# Altium project Power_Management_Board.PrjPcb
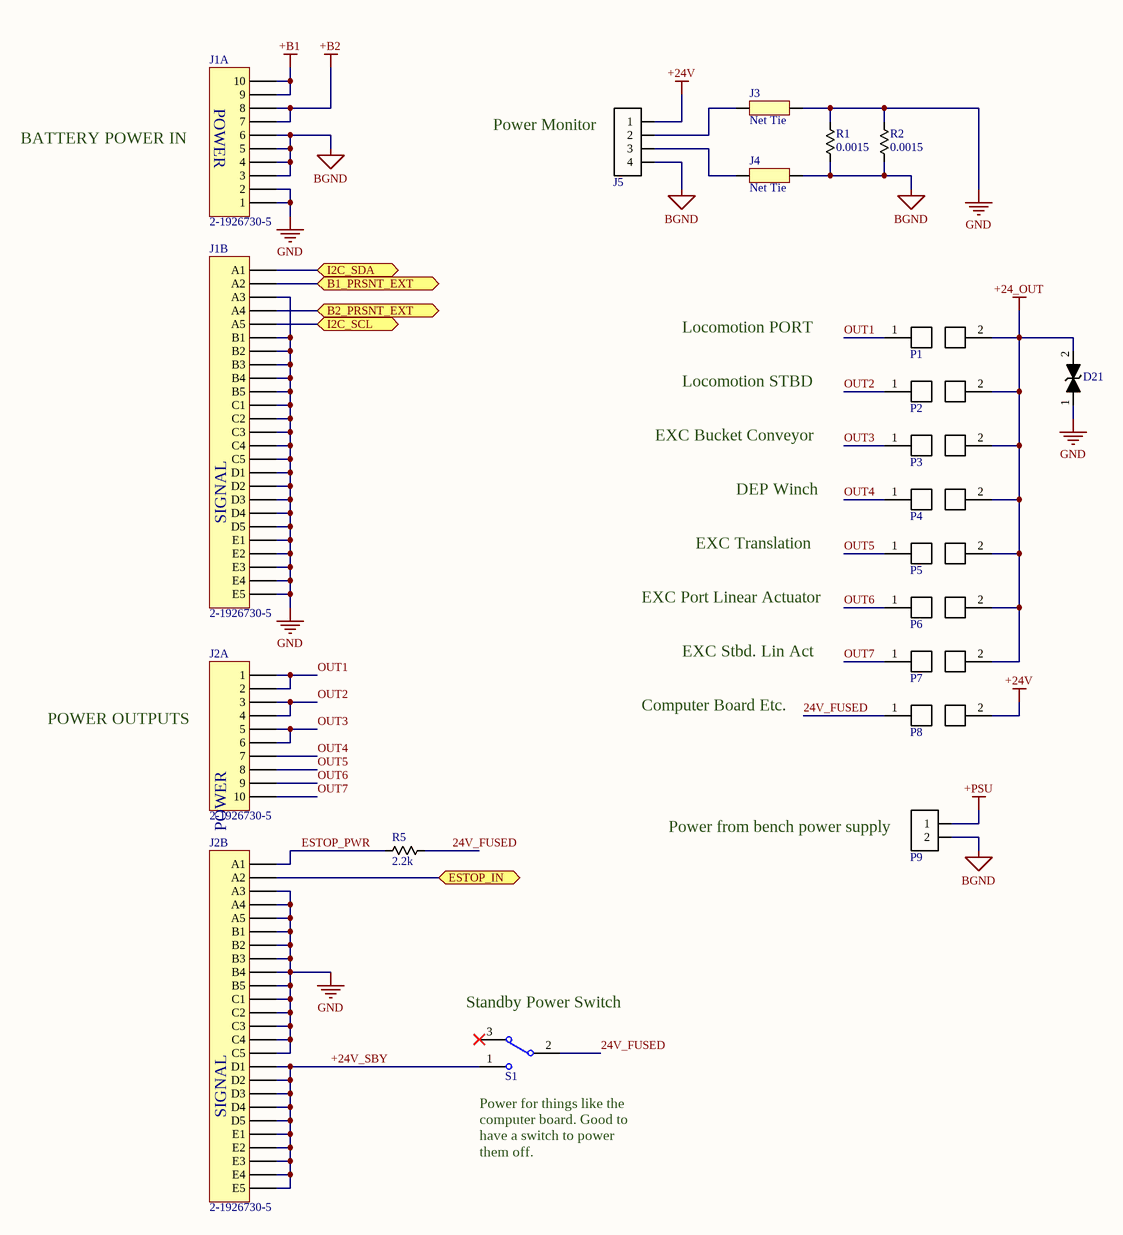
[diagram p0: SCH1_Connectors.SchDoc]
3 sheets, 145 parts. Net scope: flat (ports and power ports of the same name join across sheets).
Board file: Power_Management_Board.PcbDoc
Sheets:
  SCH1_Connectors.SchDoc
  SCH2_Switching.SchDoc
  SCH3_Microcontroller.SchDoc

## Sheet SCH1_Connectors.SchDoc
size B; Organization: CWRUbotix; Address1: 10900 Euclid Avenue; Address2: Cleveland, OH 44106; Address3: USA

### Parts
D21  diode_5  [do-214ab]  (value not drawn)
J1  2-1926730-5  [TE_CONN_2-1926730-5]  (parts A,B of 2)
J2  2-1926730-5  [TE_CONN_2-1926730-5]  (parts A,B of 2)
J3  Net Tie  [net_tie_0]
J4  Net Tie  [net_tie_0]
J5  conn-4x1_0  [PHOENIX_1757268]  (value not drawn)
P1  conn-fuse-holder_0  [FUSE_HOLDER_KEYSTONE_3557-2]  (value not drawn)
P2  conn-fuse-holder_0  [FUSE_HOLDER_KEYSTONE_3557-2]  (value not drawn)
P3  conn-fuse-holder_0  [FUSE_HOLDER_KEYSTONE_3557-2]  (value not drawn)
P4  conn-fuse-holder_0  [FUSE_HOLDER_KEYSTONE_3557-2]  (value not drawn)
P5  conn-fuse-holder_0  [FUSE_HOLDER_KEYSTONE_3557-2]  (value not drawn)
P6  conn-fuse-holder_0  [FUSE_HOLDER_KEYSTONE_3557-2]  (value not drawn)
P7  conn-fuse-holder_0  [FUSE_HOLDER_KEYSTONE_3557-2]  (value not drawn)
P8  conn-fuse-holder_0  [FUSE_HOLDER_KEYSTONE_3557-2]  (value not drawn)
P9  conn-2x1_0  [PHOENIX_1757242]  (value not drawn)
R1  0.0015  [chip_2512]
R2  0.0015  [chip_2512]
R5  2.2k  [chip_0805]
S1  SW-SPDT  [M2012TXG41-DC]  (value not drawn)

### Ports
B1_PRSNT_EXT (bidir), B2_PRSNT_EXT (bidir), ESTOP_IN (bidir), I2C_SCL (bidir), I2C_SDA (bidir)

### Nets
+24_OUT: D21.2 P1.2 P2.2 P3.2 P4.2 P5.2 P6.2 P7.2
+24V: J5.1 P8.2
+B1: J1.9 J1.10
+B2: J1.7 J1.8
+PSU: P9.1
BGND: J1.3 J1.4 J1.5 J1.6 J4.2(NET2) J5.4 P9.2 R1.2 R2.2
GND: D21.1 J1.1 J1.2 J1.A3 J1.B1 J1.B2 J1.B3 J1.B4 J1.B5 J1.C1 J1.C2 J1.C3 J1.C4 J1.C5 J1.D1 J1.D2 J1.D3 J1.D4 J1.D5 J1.E1 J1.E2 J1.E3 J1.E4 J1.E5 J2.A3 J2.A4 J2.A5 J2.B1 J2.B2 J2.B3 J2.B4 J2.B5 J2.C1 J2.C2 J2.C3 J2.C4 J2.C5 J3.2(NET2) R1.1 R2.1
24V_FUSED: P8.1 R5.2 S1.2
+24V_SBY: J2.D1 J2.D2 J2.D3 J2.D4 J2.D5 J2.E1 J2.E2 J2.E3 J2.E4 J2.E5 S1.1
B1_PRSNT_EXT: J1.A2 ; port B1_PRSNT_EXT
B2_PRSNT_EXT: J1.A4 ; port B2_PRSNT_EXT
ESTOP_IN: J2.A2 ; port ESTOP_IN
ESTOP_PWR: J2.A1 R5.1
I2C_SCL: J1.A5 ; port I2C_SCL
I2C_SDA: J1.A1 ; port I2C_SDA
OUT1: J2.1 J2.2 P1.1
OUT2: J2.3 J2.4 P2.1
OUT3: J2.5 J2.6 P3.1
OUT4: J2.7 P4.1
OUT5: J2.8 P5.1
OUT6: J2.9 P6.1
OUT7: J2.10 P7.1
NetJ3_1: J3.1(NET1) J5.2
NetJ4_1: J4.1(NET1) J5.3

Not connected (* = marked no-connect by the designer): S1 3*

### Notes on the sheet
- BATTERY POWER IN
- (near J5) Power Monitor
- Locomotion PORT
- Locomotion STBD
- EXC Bucket Conveyor
- DEP Winch
- EXC Translation
- EXC Port Linear Actuator
- EXC Stbd. Lin Act
- POWER OUTPUTS
- Computer Board Etc.
- (near P9) Power from bench power supply
- (near S1) Standby Power Switch
- (near S1) Power for things like the computer board. Good to have a switch to power them off.
- Title
- Size:
- B
- Number:
- Revision:
- Date:
- Sheet
- of
- (in symbol CONN-00093, part A) POWER
- (in symbol CONN-00093, part B) SIGNAL

### Library data of the parts
D21 = DIO-00090: TVS, 28V, 45.5V@66A, 3kW 66A Peak, Bidirectional, DO-214AC; Manufacturer: ST; Manufacturer PN: SMC30J28CA; Reverse Breakdown Voltage: 31.1V; Power Rating: 3000W; Part Number: DIO-00090; Current Rating: 66A; Type: TVS; Cost: 1.2; Distributor Link: https://www.digikey.com/en/products/detail/stmicroelectronics/SMC30J28CA/2826980
J1 J2 = CONN-00093: Backplane Header, Blades and Pins, Edge Mount Right Angle, 10 Power 25 Signal; Manufacturer: TE Connectivity; Positions per level: 35; Levels: 1; Part Number: CONN-00093; Type: Header; Manufacturer PN: 2-1926730-5; Cost: 11.68
J3 J4 = MISC-00039: Part Number: MISC-00039
J5 = CONN-00096: Terminal Block Header, 4 pos, 12A 300V, Right-Angle, THT; Manufacturer: Phoenix Contact; Manufacturer PN: 1757268; Positions per level: 4; Levels: 1; Part Number: CONN-00096; Type: Terminal Block; Cost: 1.4
P1-P8 = CONN-00015: Fuse Holder, 30A, 500V, LP-Mini 897, ATOF 257; Manufacturer: Keystone Electronics; Manufacturer PN: 3557-2; Positions per level: 2; Levels: 1; Current: 30; Part Number: CONN-00015; Cost: 1.03
P9 = CONN-00102: Terminal Blk Header, 2 Pos, 5.08mm, 12A, Right-Angle; Manufacturer: Phoenix Contact; Manufacturer PN: 1757242; Positions per level: 2; Levels: 1; Part Number: CONN-00102; Type: Terminal Block; Cost: 0.64
R1 R2 = RES-00716: RES SMD 0.0015 OHM 1% 3W 2512 50ppm, Current Sense; Manufacturer: TE Connectivity; Manufacturer PN: TLR3A30DR0015FTDG; Part Number: RES-00716; Resistance: 0.0015; Tolerance: 1%; Power Rating: 3W; Cost: 1.04
R5 = RES-00366: RES SMD 2.2K OHM 1% 1/8W 0805; Manufacturer: Rohm Semiconductor; Manufacturer PN: KTR10EZPF2201; Power Rating: 0.125W; Part Number: RES-00366; Resistance: 2.2k; Tolerance: 1%
S1 = MISC-00009: Switch, SPDT, Rocker, Thru-hole, Right-angle; Manufacturer: NKK Switches; Manufacturer PN: M2012TXW41-DA; Part Number: MISC-00009; Cost: 5.1; Weight: 6

## Sheet SCH2_Switching.SchDoc
size B; Organization: CWRUbotix; Address1: 10900 Euclid Avenue; Address2: Cleveland, OH 44106; Address3: USA
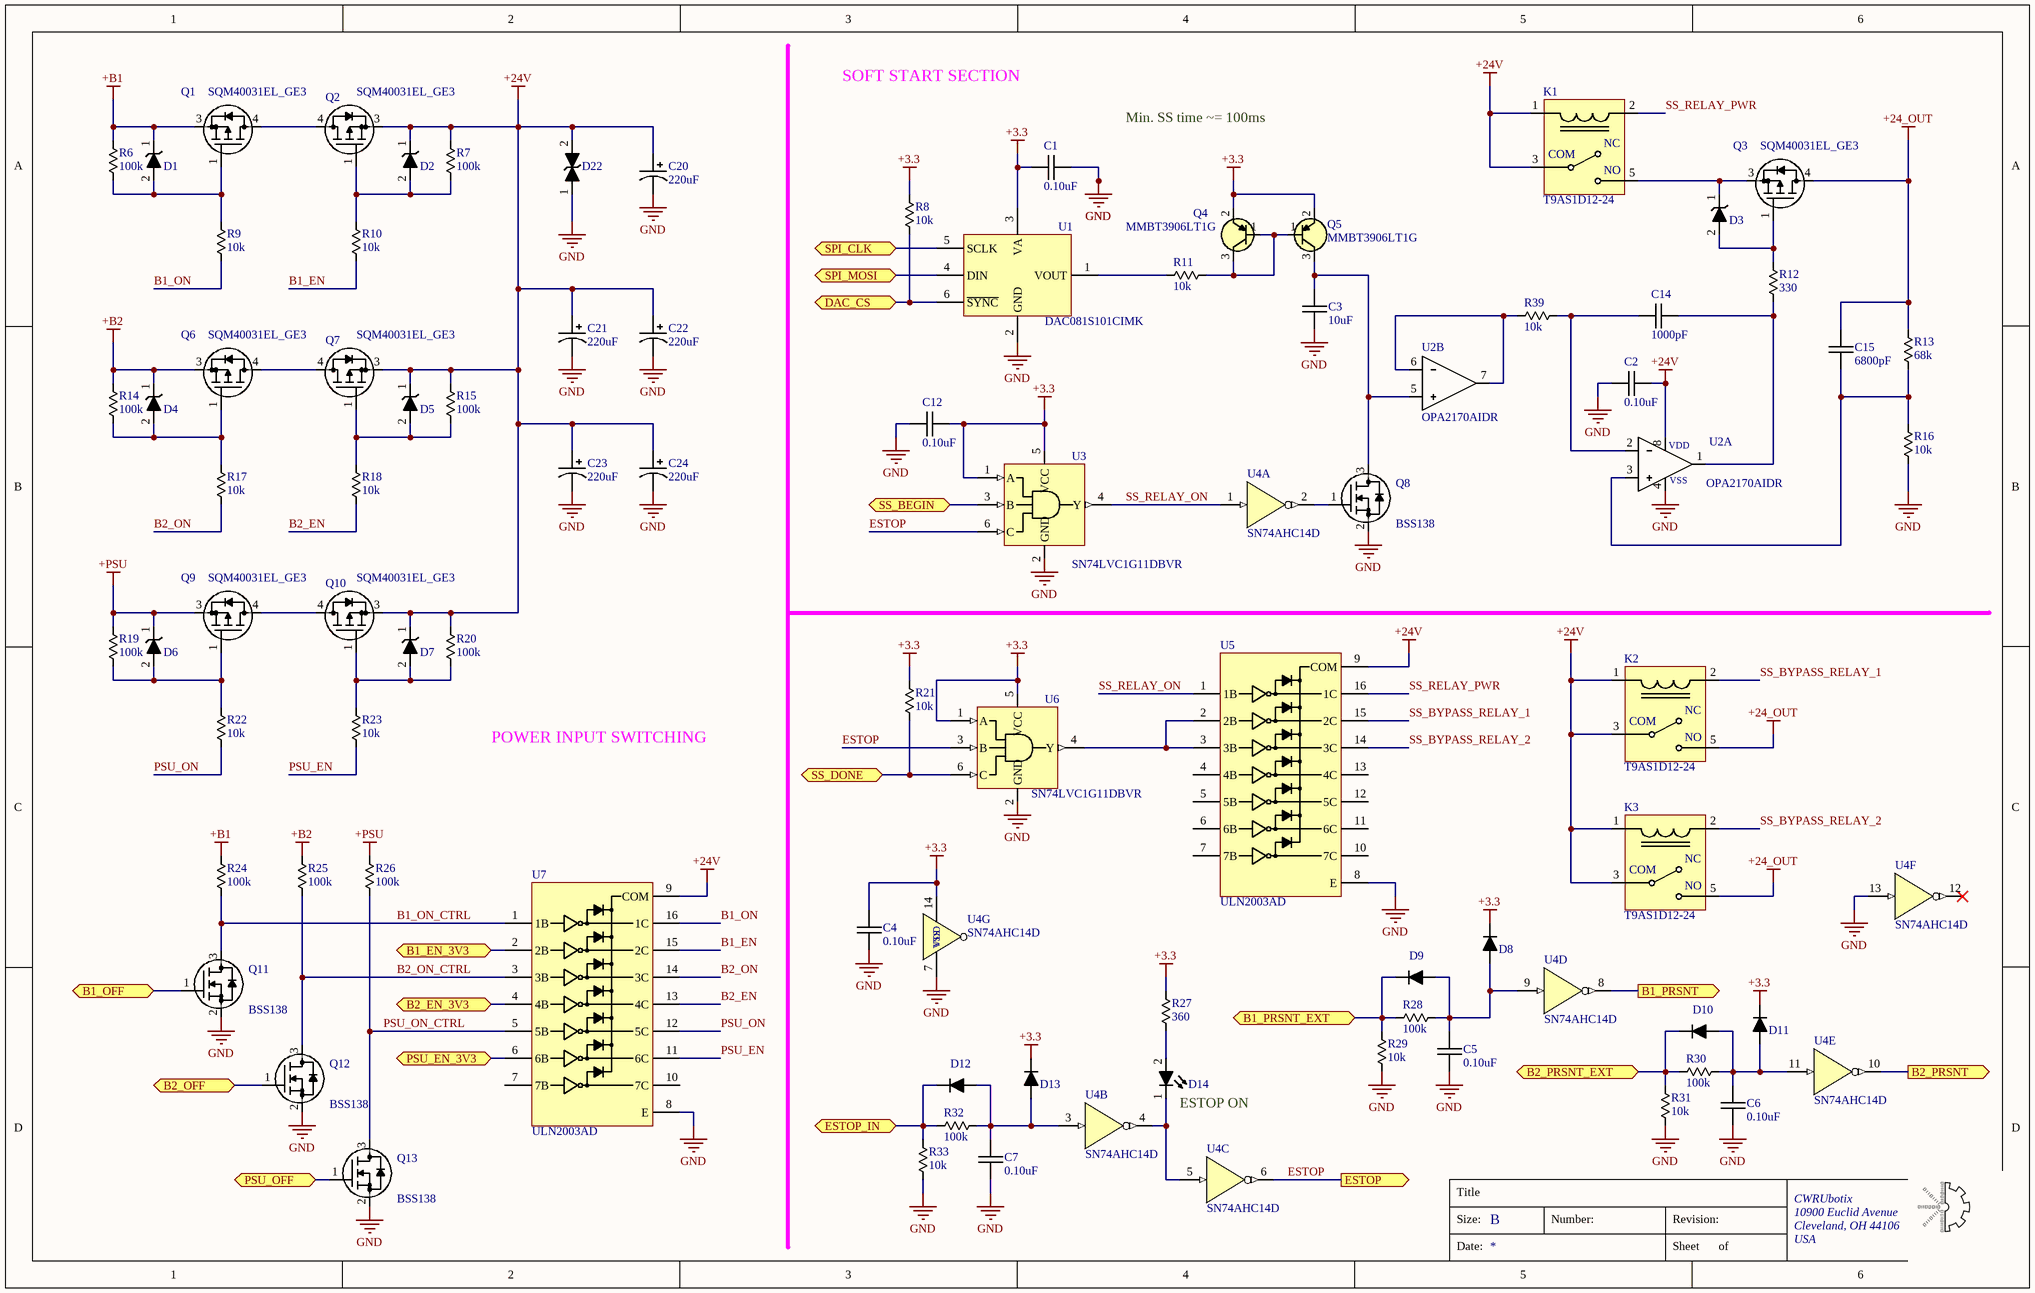
[diagram p1: SCH2_Switching.SchDoc]

### Parts
C1  0.10uF  [chip_0805]
C2  0.10uF  [chip_0805]
C3  10uF  [chip_1206]
C4  0.10uF  [chip_0805]
C5  0.10uF  [chip_0805]
C6  0.10uF  [chip_0805]
C7  0.10uF  [chip_0805]
C12  0.10uF  [chip_0805]
C14  1000pF  [chip_0805]
C15  6800pF  [chip_0805]
C20  220uF  [CP_RADIAL_D10.0_P5.0_H20.0]
C21  220uF  [CP_RADIAL_D10.0_P5.0_H20.0]
C22  220uF  [CP_RADIAL_D10.0_P5.0_H20.0]
C23  220uF  [CP_RADIAL_D10.0_P5.0_H20.0]
C24  220uF  [CP_RADIAL_D10.0_P5.0_H20.0]
D1  diode_1  [sod123_0]  (value not drawn)
D2  diode_1  [sod123_0]  (value not drawn)
D3  diode_1  [sod123_0]  (value not drawn)
D4  diode_1  [sod123_0]  (value not drawn)
D5  diode_1  [sod123_0]  (value not drawn)
D6  diode_1  [sod123_0]  (value not drawn)
D7  diode_1  [sod123_0]  (value not drawn)
D8  diode_0  [sod123_0]  (value not drawn)
D9  diode_0  [sod123_0]  (value not drawn)
D10  diode_0  [sod123_0]  (value not drawn)
D11  diode_0  [sod123_0]  (value not drawn)
D12  diode_0  [sod123_0]  (value not drawn)
D13  diode_0  [sod123_0]  (value not drawn)
D14  diode_4  [chip_0603_LED]  (value not drawn)
D22  diode_5  [do-214ab]  (value not drawn)
K1  T9AS1D12-24  [TE_CONN_T9AS]
K2  T9AS1D12-24  [TE_CONN_T9AS]
K3  T9AS1D12-24  [TE_CONN_T9AS]
Q1  SQM40031EL_GE3  [D2PAK-3_1]
Q2  SQM40031EL_GE3  [D2PAK-3_1]
Q3  SQM40031EL_GE3  [D2PAK-3_1]
Q4  MMBT3906LT1G  [SOT-23-3_1]
Q5  MMBT3906LT1G  [SOT-23-3_1]
Q6  SQM40031EL_GE3  [D2PAK-3_1]
Q7  SQM40031EL_GE3  [D2PAK-3_1]
Q8  BSS138  [sot-23-3]
Q9  SQM40031EL_GE3  [D2PAK-3_1]
Q10  SQM40031EL_GE3  [D2PAK-3_1]
Q11  BSS138  [sot-23-3]
Q12  BSS138  [sot-23-3]
Q13  BSS138  [sot-23-3]
R6  100k  [chip_0805]
R7  100k  [chip_0805]
R8  10k  [chip_0805]
R9  10k  [chip_0805]
R10  10k  [chip_0805]
R11  10k  [chip_0805]
R12  330  [chip_0805]
R13  68k  [chip_0805]
R14  100k  [chip_0805]
R15  100k  [chip_0805]
R16  10k  [chip_0805]
R17  10k  [chip_0805]
R18  10k  [chip_0805]
R19  100k  [chip_0805]
R20  100k  [chip_0805]
R21  10k  [chip_0805]
R22  10k  [chip_0805]
R23  10k  [chip_0805]
R24  100k  [chip_0805]
R25  100k  [chip_0805]
R26  100k  [chip_0805]
R27  360  [chip_0805]
R28  100k  [chip_0805]
R29  10k  [chip_0805]
R30  100k  [chip_0805]
R31  10k  [chip_0805]
R32  100k  [chip_0805]
R33  10k  [chip_0805]
R39  10k  [chip_0805]
U1  DAC081S101CIMK  [TSOT-23-6]
U2  OPA2170AIDR  [SO-8_1]  (parts A,B of 2)
U3  SN74LVC1G11DBVR  [sot-23-6]
U4  SN74AHC14D  [SO-14]  (parts A,B,C,D,E,F,G of 7)
U5  ULN2003AD  [SO-16_1]
U6  SN74LVC1G11DBVR  [sot-23-6]
U7  ULN2003AD  [SO-16_1]

### Ports
B1_EN_3V3 (bidir), B1_OFF (bidir), B1_PRSNT (out), B1_PRSNT_EXT (bidir), B2_EN_3V3 (bidir), B2_OFF (bidir), B2_PRSNT (out), B2_PRSNT_EXT (bidir), DAC_CS (bidir), ESTOP (out), ESTOP_IN (bidir), PSU_EN_3V3 (bidir), PSU_OFF (bidir), SPI_CLK (bidir), SPI_MOSI (bidir), SS_BEGIN (bidir), SS_DONE (bidir)

### Nets
+3.3: C1.2 C4.2 C12.2 D8.1 D11.1 D13.1 Q4.2(E) Q5.2(E) R8.2 R21.2 R27.1 U1.3(VA) U3.1(A) U3.5(VCC) U4.14(VDD) U6.1(A) U6.5(VCC)
+24_OUT: C15.1 K2.5(NO) K3.5(NO) Q3.4(D) R13.1
+24V: C2.2 C20.1 C21.1 C22.1 C23.1 C24.1 D2.1 D5.1 D7.1 D22.2 K1.1 K1.3(COM) K2.1 K2.3(COM) K3.1 K3.3(COM) Q2.3(S) Q7.3(S) Q10.3(S) R7.1 R15.1 R20.1 U2.8 U5.9(COM) U7.9(COM)
+B1: D1.1 Q1.3(S) R6.1 R24.1
+B2: D4.1 Q6.3(S) R14.1 R25.1
+PSU: D6.1 Q9.3(S) R19.1 R26.1
GND: C1.1 C2.1 C3.2 C4.1 C5.1 C6.1 C7.1 C12.1 C20.2 C21.2 C22.2 C23.2 C24.2 D22.1 Q8.2(S) Q11.2(S) Q12.2(S) Q13.2(S) R16.2 R29.1 R31.1 R33.1 U1.2(GND) U2.4 U3.2(GND) U4.7(VSS) U4.13(F) U5.8(E) U6.2(GND) U7.8(E)
B1_EN: R10.2 U7.15(2C)
B1_EN_3V3: U7.2(2B) ; port B1_EN_3V3
B1_OFF: Q11.1(G) ; port B1_OFF
B1_ON: R9.2 U7.16(1C)
B1_ON_CTRL: Q11.3(D) R24.2 U7.1(1B)
B1_PRSNT: U4.8(J) ; port B1_PRSNT
B1_PRSNT_EXT: D9.1 R28.1 R29.2 ; port B1_PRSNT_EXT
B2_EN: R18.2 U7.13(4C)
B2_EN_3V3: U7.4(4B) ; port B2_EN_3V3
B2_OFF: Q12.1(G) ; port B2_OFF
B2_ON: R17.2 U7.14(3C)
B2_ON_CTRL: Q12.3(D) R25.2 U7.3(3B)
B2_PRSNT: U4.10(K) ; port B2_PRSNT
B2_PRSNT_EXT: D10.1 R30.1 R31.2 ; port B2_PRSNT_EXT
DAC_CS: R8.1 U1.6(~{SYNC}) ; port DAC_CS
ESTOP: U3.6(C) U4.6(~{C}) U6.3(B) ; port ESTOP
ESTOP_IN: D12.1 R32.1 R33.2 ; port ESTOP_IN
PSU_EN: R23.2 U7.11(6C)
PSU_EN_3V3: U7.6(6B) ; port PSU_EN_3V3
PSU_OFF: Q13.1(G) ; port PSU_OFF
PSU_ON: R22.2 U7.12(5C)
PSU_ON_CTRL: Q13.3(D) R26.2 U7.5(5B)
SPI_CLK: U1.5(SCLK) ; port SPI_CLK
SPI_MOSI: U1.4(DIN) ; port SPI_MOSI
SS_BEGIN: U3.3(B) ; port SS_BEGIN
SS_BYPASS_RELAY_1: K2.2 U5.15(2C)
SS_BYPASS_RELAY_2: K3.2 U5.14(3C)
SS_DONE: R21.1 U6.6(C) ; port SS_DONE
SS_RELAY_ON: U3.4(Y) U4.1(A) U5.1(1B)
SS_RELAY_PWR: K1.2 U5.16(1C)
NetC3_1: C3.1 Q5.3(C) Q8.3(D) U2.5
NetC5_2: C5.2 D8.2 D9.2 R28.2 U4.9(D)
NetC6_2: C6.2 D10.2 D11.2 R30.2 U4.11(E)
NetC7_2: C7.2 D12.2 D13.2 R32.2 U4.3(B)
NetC14_1: C14.1 R39.2 U2.2
NetC14_2: C14.2 R12.1 U2.1
NetC15_2: C15.2 R13.2 R16.1 U2.3
NetD1_2: D1.2 Q1.1(G) R6.2 R9.1
NetD2_2: D2.2 Q2.1(G) R7.2 R10.1
NetD3_1: D3.1 K1.5(NO) Q3.3(S)
NetD3_2: D3.2 Q3.1(G) R12.2
NetD4_2: D4.2 Q6.1(G) R14.2 R17.1
NetD5_2: D5.2 Q7.1(G) R15.2 R18.1
NetD6_2: D6.2 Q9.1(G) R19.2 R22.1
NetD7_2: D7.2 Q10.1(G) R20.2 R23.1
NetD14_1: D14.1 U4.4(~{B}) U4.5(C)
NetD14_2: D14.2 R27.2
NetQ1_4: Q1.4(D) Q2.4(D)
NetQ4_1: Q4.1(B) Q4.3(C) Q5.1(B) R11.2
NetQ6_4: Q6.4(D) Q7.4(D)
NetQ8_1: Q8.1(G) U4.2(~{A})
NetQ9_4: Q9.4(D) Q10.4(D)
NetR11_1: R11.1 U1.1(VOUT)
NetR39_1: R39.1 U2.6 U2.7
NetU5_2: U5.2(2B) U5.3(3B) U6.4(Y)

Not connected (* = marked no-connect by the designer): U4 12(L)*; U5 4(4B) 5(5B) 6(6B) 7(7B) 10(7C) 11(6C) 12(5C) 13(4C); U7 7(7B) 10(7C)

### Notes on the sheet
- SOFT START SECTION
- Min. SS time ~= 100ms
- POWER INPUT SWITCHING
- (near D14) ESTOP ON
- Title
- Size:
- B
- Number:
- Revision:
- Date:
- Sheet
- of
- (in symbol ANLG-00068, part A) VDD; VSS
- (in symbol MISC-00050) NC

### Library data of the parts
C1 C2 C4-C7 = CAP-00071: CAP, 0.10uF, 10%, 25V, X7R, 0805; Manufacturer: Murata; Manufacturer PN: GRM21BR71E104KA01L; Part Number: CAP-00071; Capacitance: 0.10uF; Tolerance: 10%; Voltage Rating: 25V; Type: X7R
C3 = CAP-00539: CAP, 10uF, ±10%, 25V, X7R, 1206; Manufacturer: Samsung; Manufacturer PN: CL31B106KAHNNNE; Part Number: CAP-00539; Capacitance: 10uF; Tolerance: ±10%; Voltage Rating: 25V; Type: X7R
C12 = CAP-00069: CAP, 0.10uF, 10%, 16V, X7R, 0805; Manufacturer: Murata; Manufacturer PN: GRM219R71C104KA01D; Part Number: CAP-00069; Capacitance: 0.10uF; Tolerance: 10%; Voltage Rating: 16V; Type: X7R
C14 = CAP-00009: CAP, 1000pF, 10%, 50V, X7R, 0805; Manufacturer: Murata; Manufacturer PN: GRM216R71H102KA01D; Part Number: CAP-00009; Capacitance: 1000pF; Tolerance: 10%; Voltage Rating: 50V; Type: X7R
C15 = CAP-00035: CAP, 6800pF, 10%, 50V, X7R, 0805; Manufacturer: Murata; Manufacturer PN: GRM216R71H682KA01D; Part Number: CAP-00035; Capacitance: 6800pF; Tolerance: 10%; Voltage Rating: 50V; Type: X7R
C20-C24 = CAP-00591: CAP, 220uF, ±20%, 63V, Al, 5000hrs @ 105°C; Manufacturer: Nichicon; Manufacturer PN: UPW1J221MPD; Part Number: CAP-00591; Capacitance: 220uF; Tolerance: ±20%; Voltage Rating: 63V; Type: Al; Cost: $0.70; Distributor Link: https://www.digikey.com/en/products/detail/nichicon/UPW1J221MPD/589683
D1-D7 = DIO-00072: Dio, Zener, 12V 5% 500mW SOD-123; Manufacturer: ON Semi; Manufacturer PN: MMSZ5242BT1G; Forward Voltage: 0.9V; Current Rating: 40mA; Part Number: DIO-00072; Reverse Breakdown Voltage: 12V; Tolerance: 5%; Power Rating: 500mW; Type: Zener; Cost: 0.21
D8-D13 = DIO-00060: Dio, Silicon, 200mA, 1V, 100V, SOD-123; Manufacturer: ON Semi; Manufacturer PN: SMMSD4148T3G; Forward Voltage: 1.0V; Part Number: DIO-00060; Reverse Breakdown Voltage: 100V; Current Rating: 200mA; Type: Silicon; Cost: 0.38
D14 = DIO-00049: LED, Blue, 0603, Low current, HELI2 Series; Manufacturer: Kingbright; Manufacturer PN: APT1608LVBC/D; Forward Voltage: 2.65V; Reverse Breakdown Voltage: 5V; Power Rating: 120mW; Current Rating: 30mA; Part Number: DIO-00049; Type: LED; Cost: 0.58
D22 = DIO-00090: as D21 on sheet SCH1_Connectors; Part Number: DIO-00090; Current Rating: 66A; Type: TVS; Cost: 1.2; Distributor Link: https://www.digikey.com/en/products/detail/stmicroelectronics/SMC30J28CA/2826980
K1-K3 = MISC-00050: Relay, 24V Coil, 30A, SPST, 1 Form A; Manufacturer: TE Connectivity; Part Number: MISC-00050; Manufacturer PN: T9AS1D12-24; Cost: 5.04
Q1-Q3 Q6 Q7 Q9 Q10 = XSTR-00046: XSTR, MOSFET P-Channel, 40V 120A 3mOhm Rds On, D2PAK; Manufacturer: Vishay Siliconix; Max Power: 375W; Type: PMOS; Vgs/Vce: 2.5V; Part Number: XSTR-00046; Max Voltage: 40V; Max Current: 120A; Manufacturer PN: SQM40031EL_GE3; Cost: 2.81
Q4 Q5 = XSTR-00038: XSTR, PNP, 200mA, 40V, Vce 0.4V, SOT-23-3; Manufacturer: ON Semi; Max Power: 300mW; Part Number: XSTR-00038; Max Voltage: 40V; Max Current: 200mA; Type: PNP; Vgs/Vce: 0.4V; Manufacturer PN: MMBT3906LT1G; Cost: 0.12
Q8 Q11-Q13 = XSTR-00017: XSTR NMOS, 220mA, 50V, Vgs 1.3V, SOT-23-3; Manufacturer: ON Semi; Max Power: 360mW; Type: NFET; Part Number: XSTR-00017; Max Voltage: 50V; Max Current: 220mA; Vgs/Vce: 1.3V; Manufacturer PN: BSS138; Cost: 0.31
R6 R7 R14 R15 R19 R20 R24-R26 R28 R30 R32 = RES-00302: RES SMD 100K OHM 1% 1/8W 0805; Manufacturer: Rohm Semiconductor; Manufacturer PN: KTR10EZPF1003; Power Rating: 0.125W; Part Number: RES-00302; Resistance: 100k; Tolerance: 1%
R8-R11 R16-R18 R21-R23 R29 R31 R33 R39 = RES-00307: RES SMD 10K OHM 1% 1/8W 0805; Manufacturer: Rohm Semiconductor; Manufacturer PN: KTR10EZPF1002; Power Rating: 0.125W; Part Number: RES-00307; Resistance: 10k; Tolerance: 1%
R12 = RES-00222: RES SMD 330 OHM 1% 1/8W 0805; Manufacturer: Rohm Semiconductor; Manufacturer PN: KTR10EZPF3300; Power Rating: 0.125W; Part Number: RES-00222; Resistance: 330; Tolerance: 1%
R13 = RES-00724: RES SMD 68K OHM 1% 1/8W 0805 100ppm; Manufacturer: Yageo; Manufacturer PN: RC0805FR-0768KL; Part Number: RES-00724; Resistance: 68k; Tolerance: 1%; Power Rating: 1/8W; Cost: 0.1
R27 = RES-00226: RES SMD 360 OHM 1% 1/8W 0805; Manufacturer: Rohm Semiconductor; Manufacturer PN: KTR10EZPF3600; Power Rating: 0.125W; Part Number: RES-00226; Resistance: 360; Tolerance: 1%
U1 = ANLG-00080: IC, DAC, 8-bit, Rail-Rail Output, SPI, 2.7~5.5V; Manufacturer: TI; Part Number: ANLG-00080; Manufacturer PN: DAC081S101CIMK; Cost: 1.45
U2 = ANLG-00068: Op Amp, Dual, Rail-Rail, 2.7~36V, 2.1-MHz, SOIC-8; Manufacturer: TI; Part Number: ANLG-00068; Manufacturer PN: OPA2170AIDR; Cost: 1.84
U3 U6 = LOGIC-00042: IC, AND Gate, Single 3-Input, 1.65-5.5V, SOT-23-6; Manufacturer: TI; Part Number: LOGIC-00042; Manufacturer PN: SN74LVC1G11DBVR; Cost: $0.37
U4 = LOGIC-00014: IC, Inverter, Hex, Schmitt Triggered Inputs, SOIC-14, SN74ACH14D; Manufacturer: TI; Part Number: LOGIC-00014; Manufacturer PN: SN74AHC14D; Cost: $0.41
U5 U7 = ANLG-00079: IC, 7 NPN Darlington Array, 50V 500mA; Manufacturer: TI; Part Number: ANLG-00079; Manufacturer PN: ULN2003AD; Cost: 0.49

## Sheet SCH3_Microcontroller.SchDoc
size B; Organization: CWRUbotix; Address1: 10900 Euclid Avenue; Address2: Cleveland, OH 44106; Address3: USA
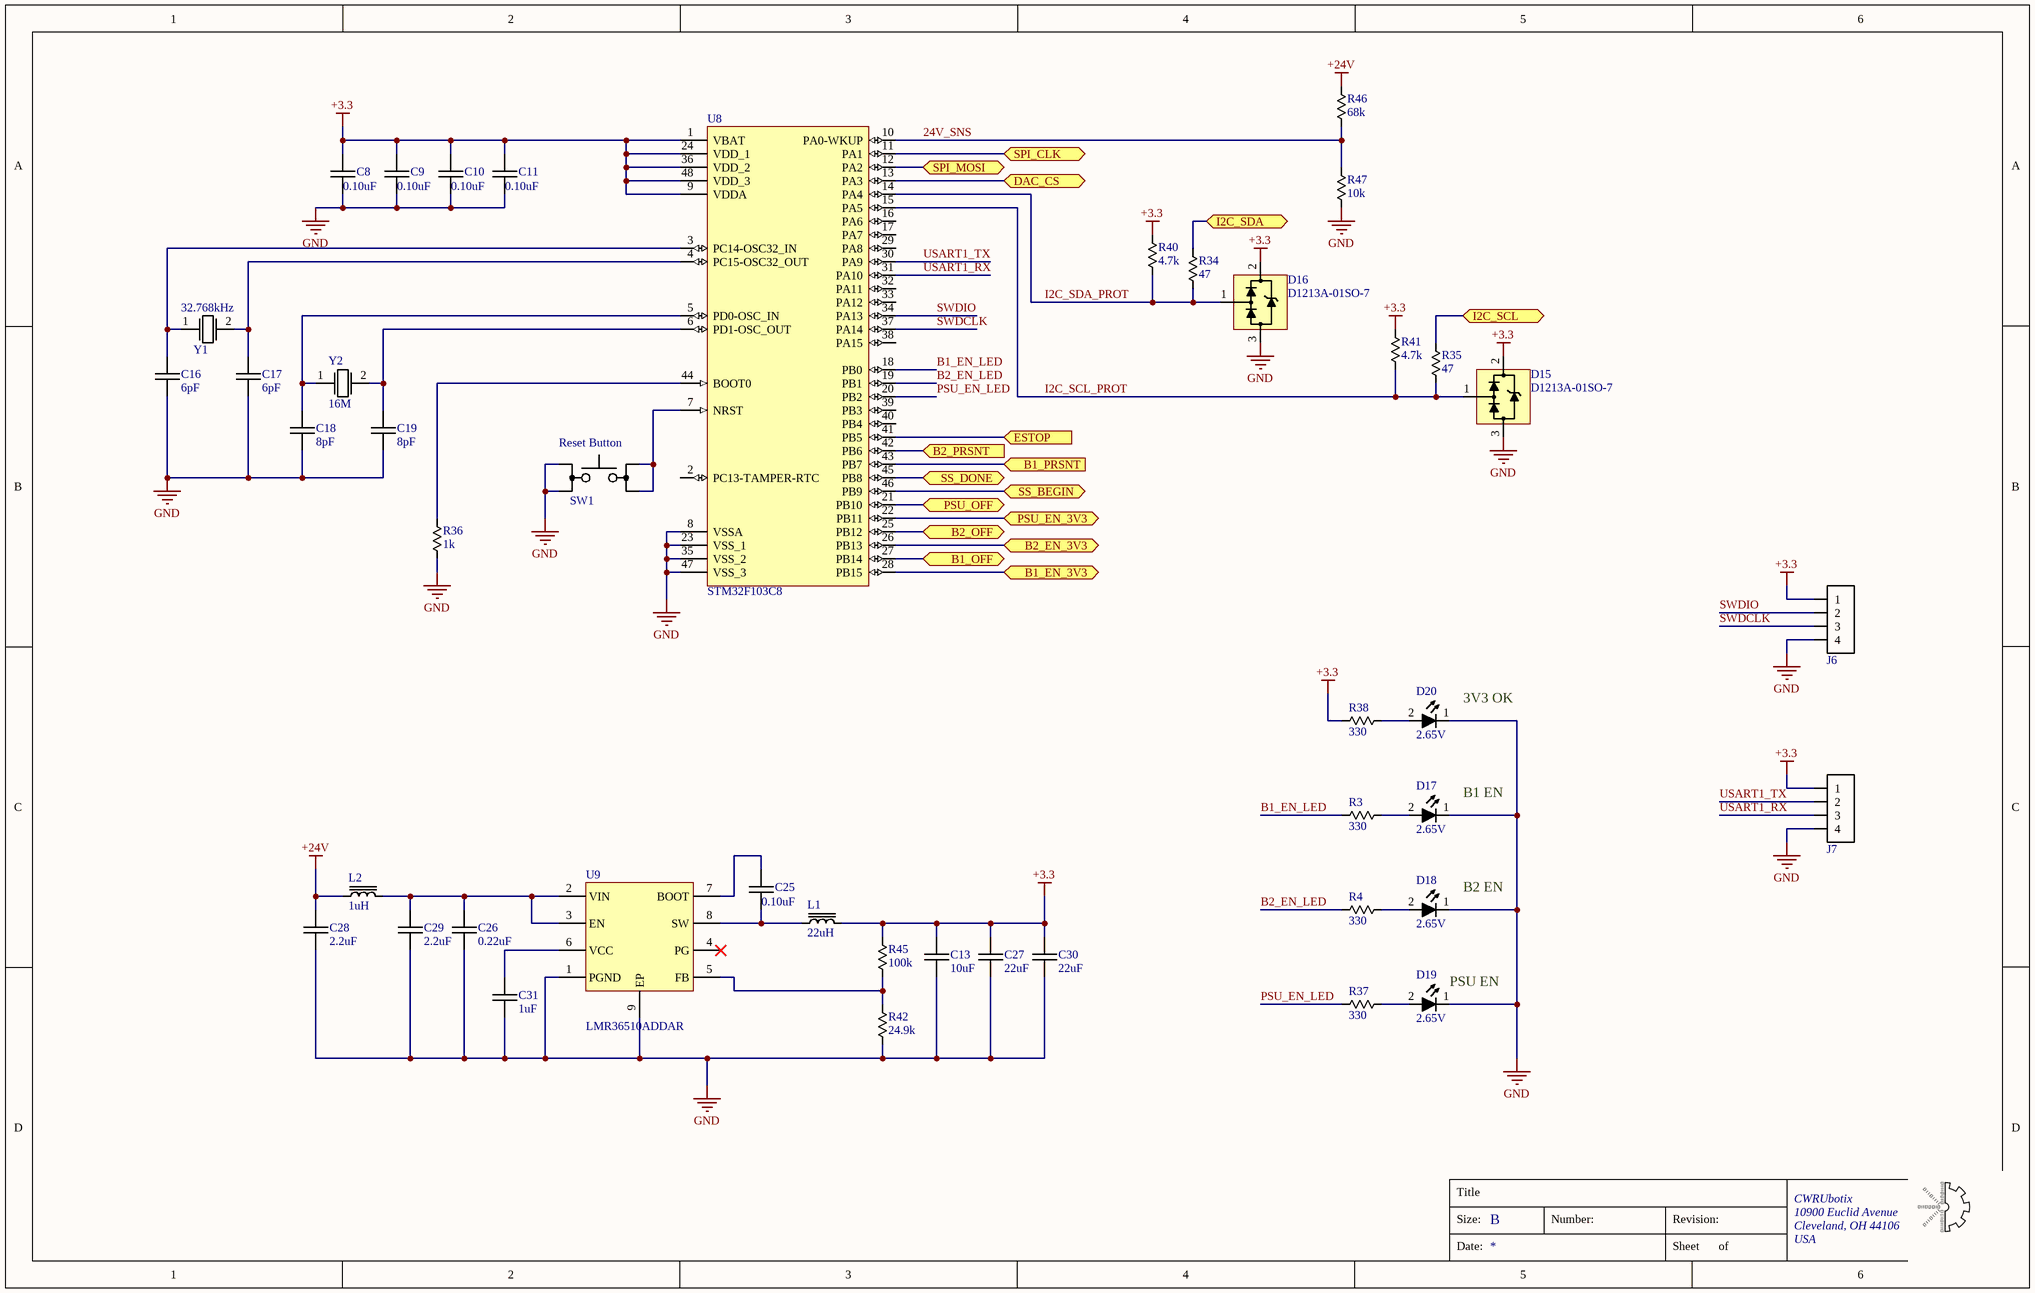
[diagram p2: SCH3_Microcontroller.SchDoc]

### Parts
C8  0.10uF  [chip_0805]
C9  0.10uF  [chip_0805]
C10  0.10uF  [chip_0805]
C11  0.10uF  [chip_0805]
C13  10uF  [chip_1206]
C16  6pF  [chip_0603]
C17  6pF  [chip_0603]
C18  8pF  [chip_0603]
C19  8pF  [chip_0603]
C25  0.10uF  [chip_0805]
C26  0.22uF  [chip_0805]
C27  22uF  [chip_1206]
C28  2.2uF  [chip_1206]
C29  2.2uF  [chip_1206]
C30  22uF  [chip_1206]
C31  1uF  [chip_0805]
D15  D1213A-01SO-7  [SOT-23-3_1]
D16  D1213A-01SO-7  [SOT-23-3_1]
D17  2.65V  [chip_0603_LED]
D18  2.65V  [chip_0603_LED]
D19  2.65V  [chip_0603_LED]
D20  2.65V  [chip_0603_LED]
J6  conn-4x1_0  [HDDR_4x1_0]  (value not drawn)
J7  conn-4x1_0  [HDDR_4x1_0]  (value not drawn)
L1  22uH  [BOURNS_SRN5040]
L2  1uH  [chip_0805]
R3  330  [chip_0805]
R4  330  [chip_0805]
R34  47  [chip_0805]
R35  47  [chip_0805]
R36  1k  [chip_0805]
R37  330  [chip_0805]
R38  330  [chip_0805]
R40  4.7k  [chip_0805]
R41  4.7k  [chip_0805]
R42  24.9k  [chip_0805]
R45  100k  [chip_0805]
R46  68k  [chip_0805]
R47  10k  [chip_0805]
SW1  SW_1P1T_2  [TE_CONN_3-1825910-5]  (value not drawn)
U8  STM32F103C8  [LQFP48_0]
U9  LMR36510ADDAR  [SO-8_PPAD]
Y1  osc_xtal_2p_0  [ABS25_OSC]  (value not drawn)
Y2  16M  [NX5032GA]

### Ports
B1_EN_3V3 (bidir), B1_OFF (bidir), B1_PRSNT (in), B2_EN_3V3 (bidir), B2_OFF (bidir), B2_PRSNT (in), DAC_CS (bidir), ESTOP (in), I2C_SCL (bidir), I2C_SDA (bidir), PSU_EN_3V3 (bidir), PSU_OFF (bidir), SPI_CLK (bidir), SPI_MOSI (bidir), SS_BEGIN (bidir), SS_DONE (bidir)

### Nets
+3.3: C8.1 C9.1 C10.1 C11.1 C13.1 C27.1 C30.1 D15.2(VCC) D16.2(VCC) J6.1 J7.1 L1.2 R38.1 R40.1 R41.1 R45.2 U8.1(VBAT) U8.9(VDDA) U8.24(VDD_1) U8.36(VDD_2) U8.48(VDD_3)
+24V: C28.1 L2.1 R46.1
GND: C8.2 C9.2 C10.2 C11.2 C13.2 C16.2 C17.2 C18.2 C19.2 C26.2 C27.2 C28.2 C29.2 C30.2 C31.2 D15.3(GND) D16.3(GND) D17.1 D18.1 D19.1 D20.1 J6.4 J7.4 R36.2 R42.2 R47.2 SW1.1 SW1.2 U8.8(VSSA) U8.23(VSS_1) U8.35(VSS_2) U8.47(VSS_3) U9.1(PGND) U9.9(EP)
24V_SNS: R46.2 R47.1 U8.10(PA0-WKUP)
B1_EN_3V3: U8.28(PB15) ; port B1_EN_3V3
B1_EN_LED: R3.1 U8.18(PB0)
B1_OFF: U8.27(PB14) ; port B1_OFF
B1_PRSNT: U8.43(PB7) ; port B1_PRSNT
B2_EN_3V3: U8.26(PB13) ; port B2_EN_3V3
B2_EN_LED: R4.1 U8.19(PB1)
B2_OFF: U8.25(PB12) ; port B2_OFF
B2_PRSNT: U8.42(PB6) ; port B2_PRSNT
DAC_CS: U8.13(PA3) ; port DAC_CS
ESTOP: U8.41(PB5) ; port ESTOP
I2C_SCL: R35.2 ; port I2C_SCL
I2C_SCL_PROT: D15.1(LINE) R35.1 R41.2 U8.15(PA5)
I2C_SDA: R34.2 ; port I2C_SDA
I2C_SDA_PROT: D16.1(LINE) R34.1 R40.2 U8.14(PA4)
PSU_EN_3V3: U8.22(PB11) ; port PSU_EN_3V3
PSU_EN_LED: R37.1 U8.20(PB2)
PSU_OFF: U8.21(PB10) ; port PSU_OFF
SPI_CLK: U8.11(PA1) ; port SPI_CLK
SPI_MOSI: U8.12(PA2) ; port SPI_MOSI
SS_BEGIN: U8.46(PB9) ; port SS_BEGIN
SS_DONE: U8.45(PB8) ; port SS_DONE
SWDCLK: J6.3 U8.37(PA14)
SWDIO: J6.2 U8.34(PA13)
USART1_RX: J7.3 U8.31(PA10)
USART1_TX: J7.2 U8.30(PA9)
NetC16_1: C16.1 U8.3(PC14-OSC32_IN) Y1.1
NetC17_1: C17.1 U8.4(PC15-OSC32_OUT) Y1.2
NetC18_1: C18.1 U8.5(PD0-OSC_IN) Y2.1
NetC19_1: C19.1 U8.6(PD1-OSC_OUT) Y2.2
NetC25_1: C25.1 U9.7(BOOT)
NetC25_2: C25.2 L1.1 U9.8(SW)
NetC26_1: C26.1 C29.1 L2.2 U9.2(VIN) U9.3(EN)
NetC31_1: C31.1 U9.6(VCC)
NetD17_2: D17.2 R3.2
NetD18_2: D18.2 R4.2
NetD19_2: D19.2 R37.2
NetD20_2: D20.2 R38.2
NetR36_1: R36.1 U8.44(BOOT0)
NetR42_1: R42.1 R45.1 U9.5(FB)
NetSW1_3: SW1.3 SW1.4 U8.7(NRST)

Not connected (* = marked no-connect by the designer): U8 2(PC13-TAMPER-RTC) 16(PA6) 17(PA7) 29(PA8) 32(PA11) 33(PA12) 38(PA15) 39(PB3) 40(PB4); U9 4(PG)*

### Notes on the sheet
- (near Y1) 32.768kHz
- (near SW1) Reset Button
- (near D20) 3V3 OK
- (near D17) B1 EN
- (near D18) B2 EN
- (near D19) PSU EN
- Title
- Size:
- B
- Number:
- Revision:
- Date:
- Sheet
- of

### Library data of the parts
C8-C11 C25 = CAP-00069: as C12 on sheet SCH2_Switching; Part Number: CAP-00069; Capacitance: 0.10uF; Tolerance: 10%; Voltage Rating: 16V; Type: X7R
C13 = CAP-00539: as C3 on sheet SCH2_Switching; Part Number: CAP-00539; Capacitance: 10uF; Tolerance: ±10%; Voltage Rating: 25V; Type: X7R
C16 C17 = CAP-00538: CAP, 6pF, ±10%, 50V, C0G, 0603; Part Number: CAP-00538; Capacitance: 6pF; Tolerance: ±10%; Voltage Rating: 50V; Type: C0G
C18 C19 = CAP-00402: CAP, 8pF, ±0.1pF, 50V, C0G, 0603; Manufacturer: Murata; Manufacturer PN: GRM1885C1H8R0BA01D; Part Number: CAP-00402; Capacitance: 8pF; Tolerance: ±0.1pF; Voltage Rating: 50V; Type: C0G
C26 = CAP-00080: CAP, 0.22uF, 10%, 100V, X7R, 0805; Manufacturer: Murata; Manufacturer PN: GRM21AR72A224KAC5K; Part Number: CAP-00080; Capacitance: 0.22uF; Tolerance: 10%; Voltage Rating: 100V; Type: X7R
C27 C30 = CAP-00587: CAP, 22uF, ±10%, 25V, X5R, 1206; Manufacturer: Samsung Electro-Mechanics; Manufacturer PN: CL31A226KAHNNNE; Part Number: CAP-00587; Capacitance: 22uF; Tolerance: ±10%; Voltage Rating: 25V; Type: X5R; Cost: $0.41
C28 C29 = CAP-00563: CAP, 2.2uF, ±10%, 50V, X7R, 1206; Manufacturer: KEMET; Manufacturer PN: C1206C225K5RACTU; Part Number: CAP-00563; Capacitance: 2.2uF; Tolerance: ±10%; Voltage Rating: 50V; Type: X7R; Cost: $0.33
C31 = CAP-00107: CAP, 1uF, 10%, 16V, X7R, 0805; Manufacturer: Murata; Manufacturer PN: GRM21BR71C105KA01L; Part Number: CAP-00107; Capacitance: 1uF; Tolerance: 10%; Voltage Rating: 16V; Type: X7R
D15 D16 = DIO-00075: TVS, Rail-Rail Steering + Zener Clamp, 3.3V Standoff, 10V Clamping; Manufacturer: Diodes Incorporated; Reverse Breakdown Voltage: 6V; Current Rating: 1A; Part Number: DIO-00075; Type: TVS; Manufacturer PN: D1213A-01SO-7; Cost: 0.35
D17-D20 = DIO-00049: LED, Blue, 0603, Low current, HELI2 Series; Manufacturer: Kingbright; Manufacturer PN: APT1608LVBC/D; Reverse Breakdown Voltage: 5V; Power Rating: 120mW; Current Rating: 30mA; Part Number: DIO-00049; Forward Voltage: 2.65V; Type: LED; Cost: 0.58
J6 J7 = CONN-00029: Header 4x1, 0.1"; Positions per level: 4; Levels: 1; Part Number: CONN-00029; Type: Header
L1 = MAG-00129: Ind, 10uH, 2.1A (2.3A sat.), 0.068 Ohm, SMD; Manufacturer: Bourns; Manufacturer PN: SRN5040-220M; Tolerance: 20%; Current Rating: 1.4A; DCR: 152mOhm; Part Number: MAG-00129; Inductance: 22uH; Cost: 0.46
L2 = MAG-00009: Ind, 1uH, 20%, 900mA, 0805; Manufacturer: TDK; Manufacturer PN: MLZ2012A1R0M; DCR: 100 mOhm; Part Number: MAG-00009; Inductance: 1uH; Tolerance: 20%; Current Rating: 900mA
R3 R4 R37 R38 = RES-00222: as R12 on sheet SCH2_Switching; Part Number: RES-00222; Resistance: 330; Tolerance: 1%
R34 R35 = RES-00154: RES SMD 47 OHM 1% 1/8W 0805; Manufacturer: Rohm Semiconductor; Manufacturer PN: KTR10EZPF47R0; Power Rating: 0.125W; Part Number: RES-00154; Resistance: 47; Tolerance: 1%
R36 = RES-00361: RES SMD 1K OHM 1% 1/8W 0805; Manufacturer: Rohm Semiconductor; Manufacturer PN: KTR10EZPF1001; Power Rating: 0.125W; Part Number: RES-00361; Resistance: 1k; Tolerance: 1%
R40 R41 = RES-00471: RES SMD 4.7K OHM 1% 1/8W 0805; Manufacturer: Rohm Semiconductor; Manufacturer PN: KTR10EZPF4701; Power Rating: 0.125W; Part Number: RES-00471; Resistance: 4.7k; Tolerance: 1%
R42 = RES-00396: RES SMD 24.9K OHM 1% 1/8W 0805; Manufacturer: Rohm Semiconductor; Manufacturer PN: KTR10EZPF2492; Power Rating: 0.125W; Part Number: RES-00396; Resistance: 24.9k; Tolerance: 1%
R45 = RES-00302: as R6 on sheet SCH2_Switching; Part Number: RES-00302; Resistance: 100k; Tolerance: 1%
R46 = RES-00724: as R13 on sheet SCH2_Switching; Part Number: RES-00724; Resistance: 68k; Tolerance: 1%; Power Rating: 1/8W; Cost: 0.1
R47 = RES-00307: as R8 on sheet SCH2_Switching; Part Number: RES-00307; Resistance: 10k; Tolerance: 1%
SW1 = MISC-00059: Switch, Tactile, SPST-NO, 50mA 24V, Vertical, Thru-Hole; Manufacturer: TE Connectivity; Manufacturer PN: 3-1825910-5; Part Number: MISC-00059; Cost: 0.13
U8 = UCTRL-00008: STM32 M3, LQFP-48; Manufacturer: ST; Part Number: UCTRL-00008; Manufacturer PN: STM32F103C8
U9 = PWREG-00076: REG, Synchronous Buck, 4.2V~65V, 1A, Simple Switcher; Manufacturer: TI; Voltage Range In: 4.2 ~ 65V; Voltage Range Out: 1V ~ 28V; Reg Type: SW Buck; Fixed/Adj: Adj; Part Number: PWREG-00076; Max Current: 1A; Manufacturer PN: LMR36510ADDAR; Cost: 2.35; Distributor Link: https://www.digikey.com/en/products/detail/texas-instruments/LMR36510ADDAR/11635685
Y1 = OSC-00003: XTAL, 32.768kHz, 6pF, 20ppm; Manufacturer: Abracon; Manufacturer PN: ABS25-32.768KHZ-6-T; ESR: 50k; Part Number: OSC-00003; Frequency: 32.768k; Load Capacitance: 6pF; Tolerance: 20ppm
Y2 = OSC-00000: XTAL, 16MHz, 8pF, 50, 20ppm; Manufacturer: NDK; Manufacturer PN: NX5032GA-16MHZ-STD-CSK-4; ESR: 50; Stability: 30ppm; Part Number: OSC-00000; Frequency: 16M; Load Capacitance: 8pF; Tolerance: 20ppm; Cost: 0.65

## Nets that join several sheets
+3.3: SCH2_Switching (17 pins), SCH3_Microcontroller (21 pins)
+24_OUT: SCH1_Connectors (8 pins), SCH2_Switching (5 pins)
+24V: SCH1_Connectors (J5.1 P8.2), SCH2_Switching (25 pins), SCH3_Microcontroller (C28.1 L2.1 R46.1)
+B1: SCH1_Connectors (J1.9 J1.10), SCH2_Switching (D1.1 Q1.3 R6.1 R24.1)
+B2: SCH1_Connectors (J1.7 J1.8), SCH2_Switching (D4.1 Q6.3 R14.1 R25.1)
+PSU: SCH1_Connectors (P9.1), SCH2_Switching (D6.1 Q9.3 R19.1 R26.1)
GND: SCH1_Connectors (40 pins), SCH2_Switching (30 pins), SCH3_Microcontroller (34 pins)
B1_EN_3V3: SCH2_Switching (U7.2), SCH3_Microcontroller (U8.28)
B1_OFF: SCH2_Switching (Q11.1), SCH3_Microcontroller (U8.27)
B1_PRSNT: SCH2_Switching (U4.8), SCH3_Microcontroller (U8.43)
B1_PRSNT_EXT: SCH1_Connectors (J1.A2), SCH2_Switching (D9.1 R28.1 R29.2)
B2_EN_3V3: SCH2_Switching (U7.4), SCH3_Microcontroller (U8.26)
B2_OFF: SCH2_Switching (Q12.1), SCH3_Microcontroller (U8.25)
B2_PRSNT: SCH2_Switching (U4.10), SCH3_Microcontroller (U8.42)
B2_PRSNT_EXT: SCH1_Connectors (J1.A4), SCH2_Switching (D10.1 R30.1 R31.2)
DAC_CS: SCH2_Switching (R8.1 U1.6), SCH3_Microcontroller (U8.13)
ESTOP: SCH2_Switching (U3.6 U4.6 U6.3), SCH3_Microcontroller (U8.41)
ESTOP_IN: SCH1_Connectors (J2.A2), SCH2_Switching (D12.1 R32.1 R33.2)
I2C_SCL: SCH1_Connectors (J1.A5), SCH3_Microcontroller (R35.2)
I2C_SDA: SCH1_Connectors (J1.A1), SCH3_Microcontroller (R34.2)
PSU_EN_3V3: SCH2_Switching (U7.6), SCH3_Microcontroller (U8.22)
PSU_OFF: SCH2_Switching (Q13.1), SCH3_Microcontroller (U8.21)
SPI_CLK: SCH2_Switching (U1.5), SCH3_Microcontroller (U8.11)
SPI_MOSI: SCH2_Switching (U1.4), SCH3_Microcontroller (U8.12)
SS_BEGIN: SCH2_Switching (U3.3), SCH3_Microcontroller (U8.46)
SS_DONE: SCH2_Switching (R21.1 U6.6), SCH3_Microcontroller (U8.45)